# EAGLE design Stampato (EAGLE 4.14)
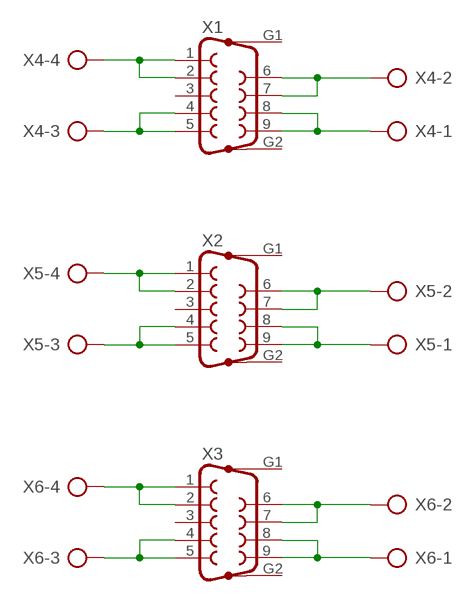
[diagram p0: schematic, sheet 1]

## Parts
X1  F09HP  [F09HP]
X2  F09HP  [F09HP]
X3  F09HP  [F09HP]
X4  AK300/4  [AK300/4]
X5  AK300/4  [AK300/4]
X6  AK300/4  [AK300/4]

## Nets
N$1: X1.1 X1.2 X4.4
N$2: X1.4 X1.5 X4.3
N$3: X1.6 X1.7 X4.2
N$4: X1.8 X1.9 X4.1
N$5: X2.1 X2.2 X5.4
N$6: X2.4 X2.5 X5.3
N$7: X2.6 X2.7 X5.2
N$8: X2.8 X2.9 X5.1
N$9: X3.1 X3.2 X6.4
N$10: X3.4 X3.5 X6.3
N$12: X3.8 X3.9 X6.1
N$13: X3.6 X3.7 X6.2
Unconnected: X1.3 X1.G1 X1.G2 X2.3 X2.G1 X2.G2 X3.3 X3.G1 X3.G2

## Library data of the parts
X1-X3 = con-subd:F09HP: SUB-D
X4-X6 = con-ptr500:AK300/4: CONNECTOR

## Board
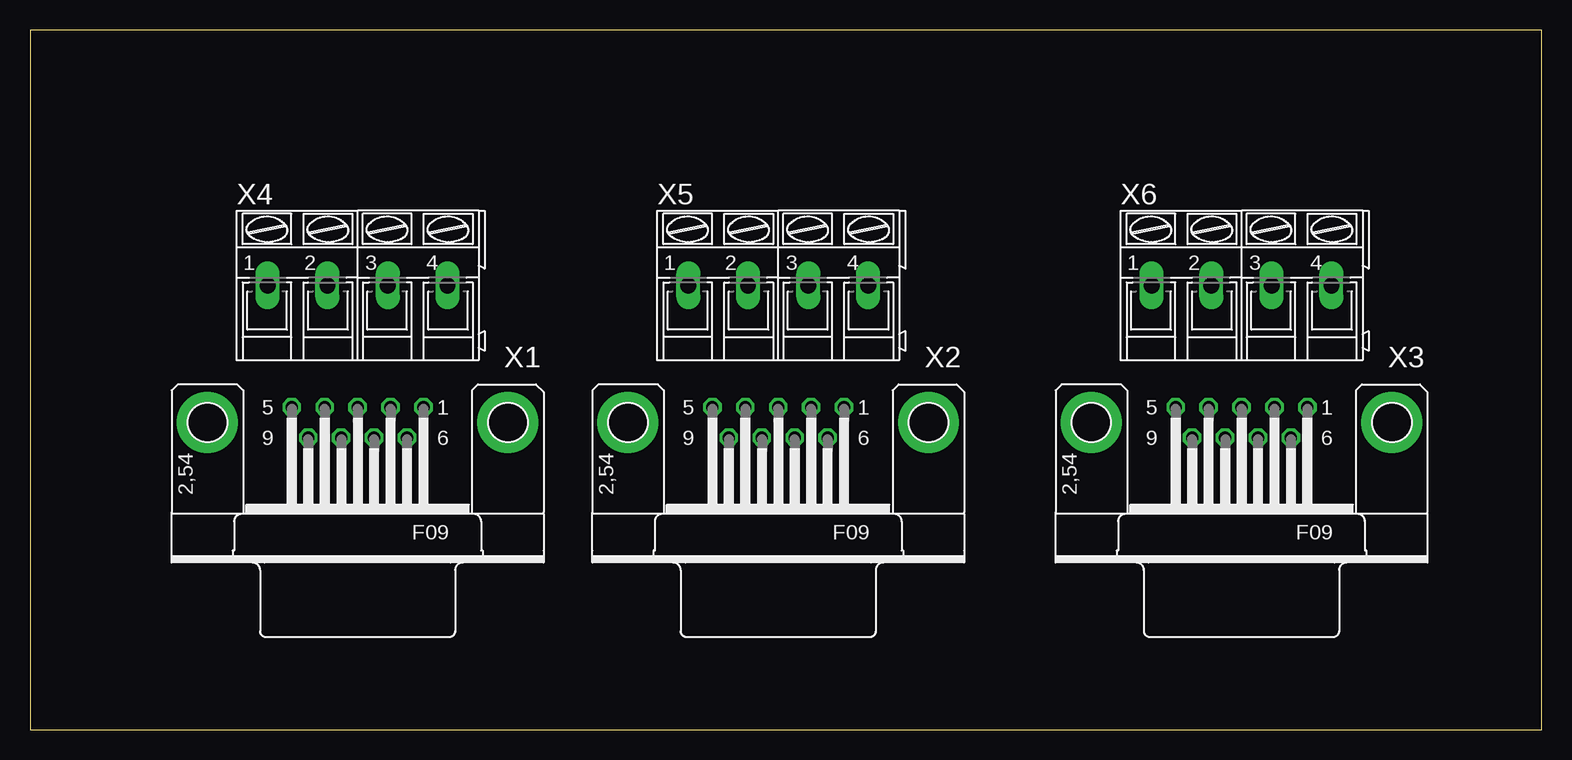
[diagram p1: board, top side]
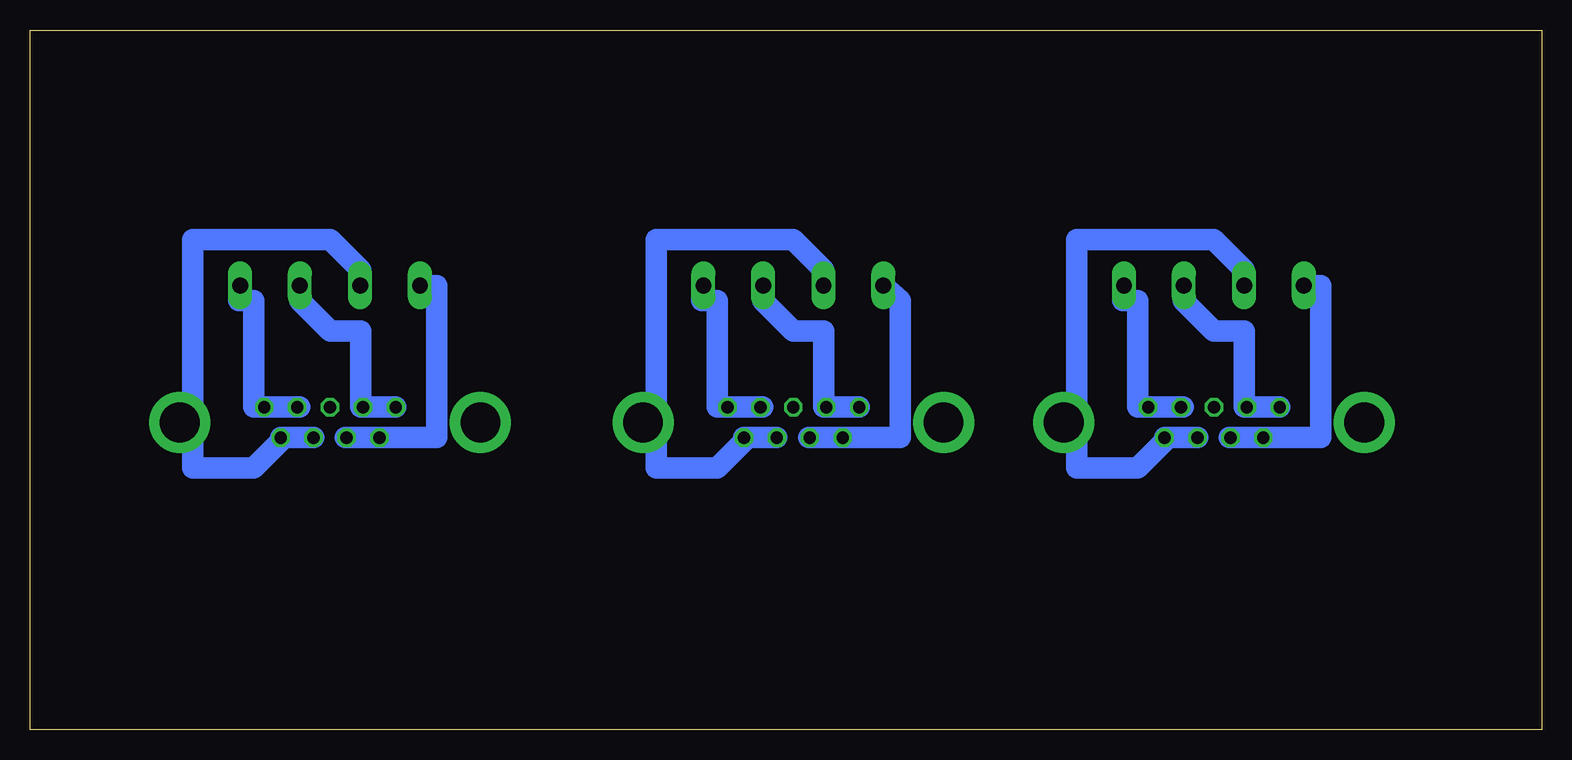
[diagram p2: board, bottom side, seen from below]

Size 125.96 x 58.34 mm. Coordinates in mm from the lower left corner, seen from the top.
Outline: 0,0 125.96,0 125.96,58.34 0,58.34 0,0
Copper layers (1*16): Top 0.035mm / dielectric 1.5mm / Bottom 0.035mm
Design rules "default": minimum track width 70mil, minimum drill 24mil, track to track 8mil, track to pad 8mil, pad to pad 8mil, via to via 8mil, smd to smd 8mil, copper to edge 40mil, drill to drill 8mil, minimum pad ring 10mil, minimum via ring 8mil, stop-mask expansion 4mil, vias tented up to drill 0mil, thermal gap 10mil

### Footprints (pad centres in the part's own frame; a part is rotated, then mirrored left to right if it is on the bottom)
F09HP = drill 1.016 octagon: 1 -5.486,-1.27; 2 -2.743,-1.27; 3 0,-1.27; 4 2.743,-1.27; 5 5.486,-1.27; 6 -4.115,1.27; 7 -1.372,1.27; 8 1.372,1.27; 9 4.115,1.27 | drill 3.302 pad 5.08 round: G1 -12.522,0; G2 12.522,0
AK300/4 = drill 1.321 long: 1 -7.493,0; 2 -2.515,0; 3 2.515,0; 4 7.493,0

### Placement (x,y rotation side)
X1  27.3,25.62 180 top
X2  62.35,25.62 180 top
X3  100.96,25.62 180 top
X4  27.3,37.05 0 top
X5  62.35,37.05 0 top
X6  100.96,37.05 0 top

### Tracks (layer width: path | path; a pad name or v marks a point on that pad's centre or on a via)
N$1
  Bottom 1.778: 29.84,26.89 X1.2 X1.1 33.65,26.89 33.65,35.78 34.92,35.78 X4.4
N$2
  Bottom 1.778: X1.5 X1.4 24.76,26.89 24.76,33.24 27.3,33.24 29.84,35.78 X4.3
N$3
  Bottom 1.778: X1.7 31.11,24.35 | 31.11,24.35 33.65,21.81 38.73,21.81 38.73,40.86 27.3,40.86 24.76,38.32 X4.2 | 31.11,24.35 X1.6
N$4
  Bottom 1.778: 26.03,24.35 X1.8 X1.9 18.41,24.35 18.41,37.05 X4.1
N$5
  Bottom 1.778: 64.89,26.89 X2.2 X2.1 68.7,26.89 68.7,35.78 69.97,35.78 X5.4
N$6
  Bottom 1.778: X2.5 X2.4 59.81,26.89 59.81,33.24 62.35,33.24 64.89,35.78 X5.3
N$7
  Bottom 1.778: X2.7 66.16,24.35 | 66.16,24.35 68.7,21.81 73.78,21.81 73.78,40.86 62.35,40.86 59.81,38.32 X5.2 | 66.16,24.35 X2.6
N$8
  Bottom 1.778: 61.08,24.35 X2.8 X2.9 53.46,24.35 53.46,35.78 X5.1
N$9
  Bottom 1.778: 103.5,26.89 X3.2 X3.1 107.31,26.89 107.31,35.78 108.58,35.78 X6.4
N$10
  Bottom 1.778: X3.5 X3.4 98.42,26.89 98.42,33.24 100.96,33.24 103.5,35.78 X6.3
N$12
  Bottom 1.778: 99.69,24.35 X3.8 X3.9 92.07,24.35 92.07,37.05 X6.1
N$13
  Bottom 1.778: X3.7 104.77,24.35 | 104.77,24.35 107.31,21.81 112.39,21.81 112.39,40.86 100.96,40.86 98.42,38.32 X6.2 | 104.77,24.35 X3.6